# EAGLE schematic antenna (EAGLE 7.3.0)
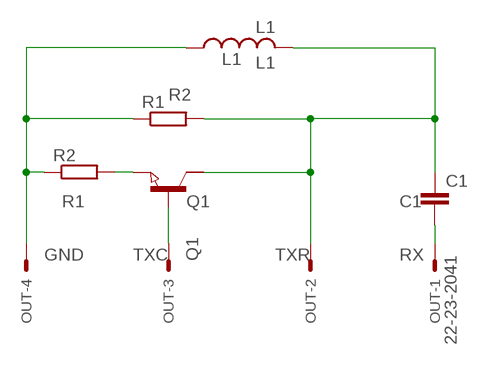
[diagram p0: schematic, sheet 1]

## Parts
C1  C2,5-3  [C2.5-3]
L1  L1  L-US0204/5  [0204/5]
OUT  22-23-2041  [22-23-2041]
Q1  NPN-TRANSISTIOR-2COLSOT89  [SOT89]
R1  R-EU_0207/15  [0207/15]
R2  R-EU_0207/15  [0207/15]

## Nets
N$1: C1.1 L1.2 OUT.2 Q1.2(C) R1.2
N$2: L1.1 OUT.4 R1.1 R2.1
N$3: OUT.3 Q1.1(B)
N$4: Q1.3(E) R2.2
RX: C1.2 OUT.1
Unconnected: Q1.2@1(C/)

## Notes on the sheet
- L1
- R2
- R1 | Q1 | C1
- GND | TXC | TXR | RX

## Library data of the parts
C1 = capacitor-wima:C: CAPACITOR naming: grid - package width
L1 = rcl:L-US: INDUCTOR, American symbol
OUT = con-molex:22-23-2041: .100" (2.54mm) Center Header - 4 Pin; MF: MOLEX; MPN: 22-23-2041; OC_FARNELL: 1462920; OC_NEWARK: 38C0355
Q1 = semicon-smd-ipc:NPN-TRANSISTIOR-2COL: NPN TRANSISTOR 2 colletor pins
R1 R2 = rcl:R-EU_: RESISTOR, European symbol